# EAGLE schematic 1-voice(1_1) (EAGLE 9.2.1)

## Sheet 1 of 2
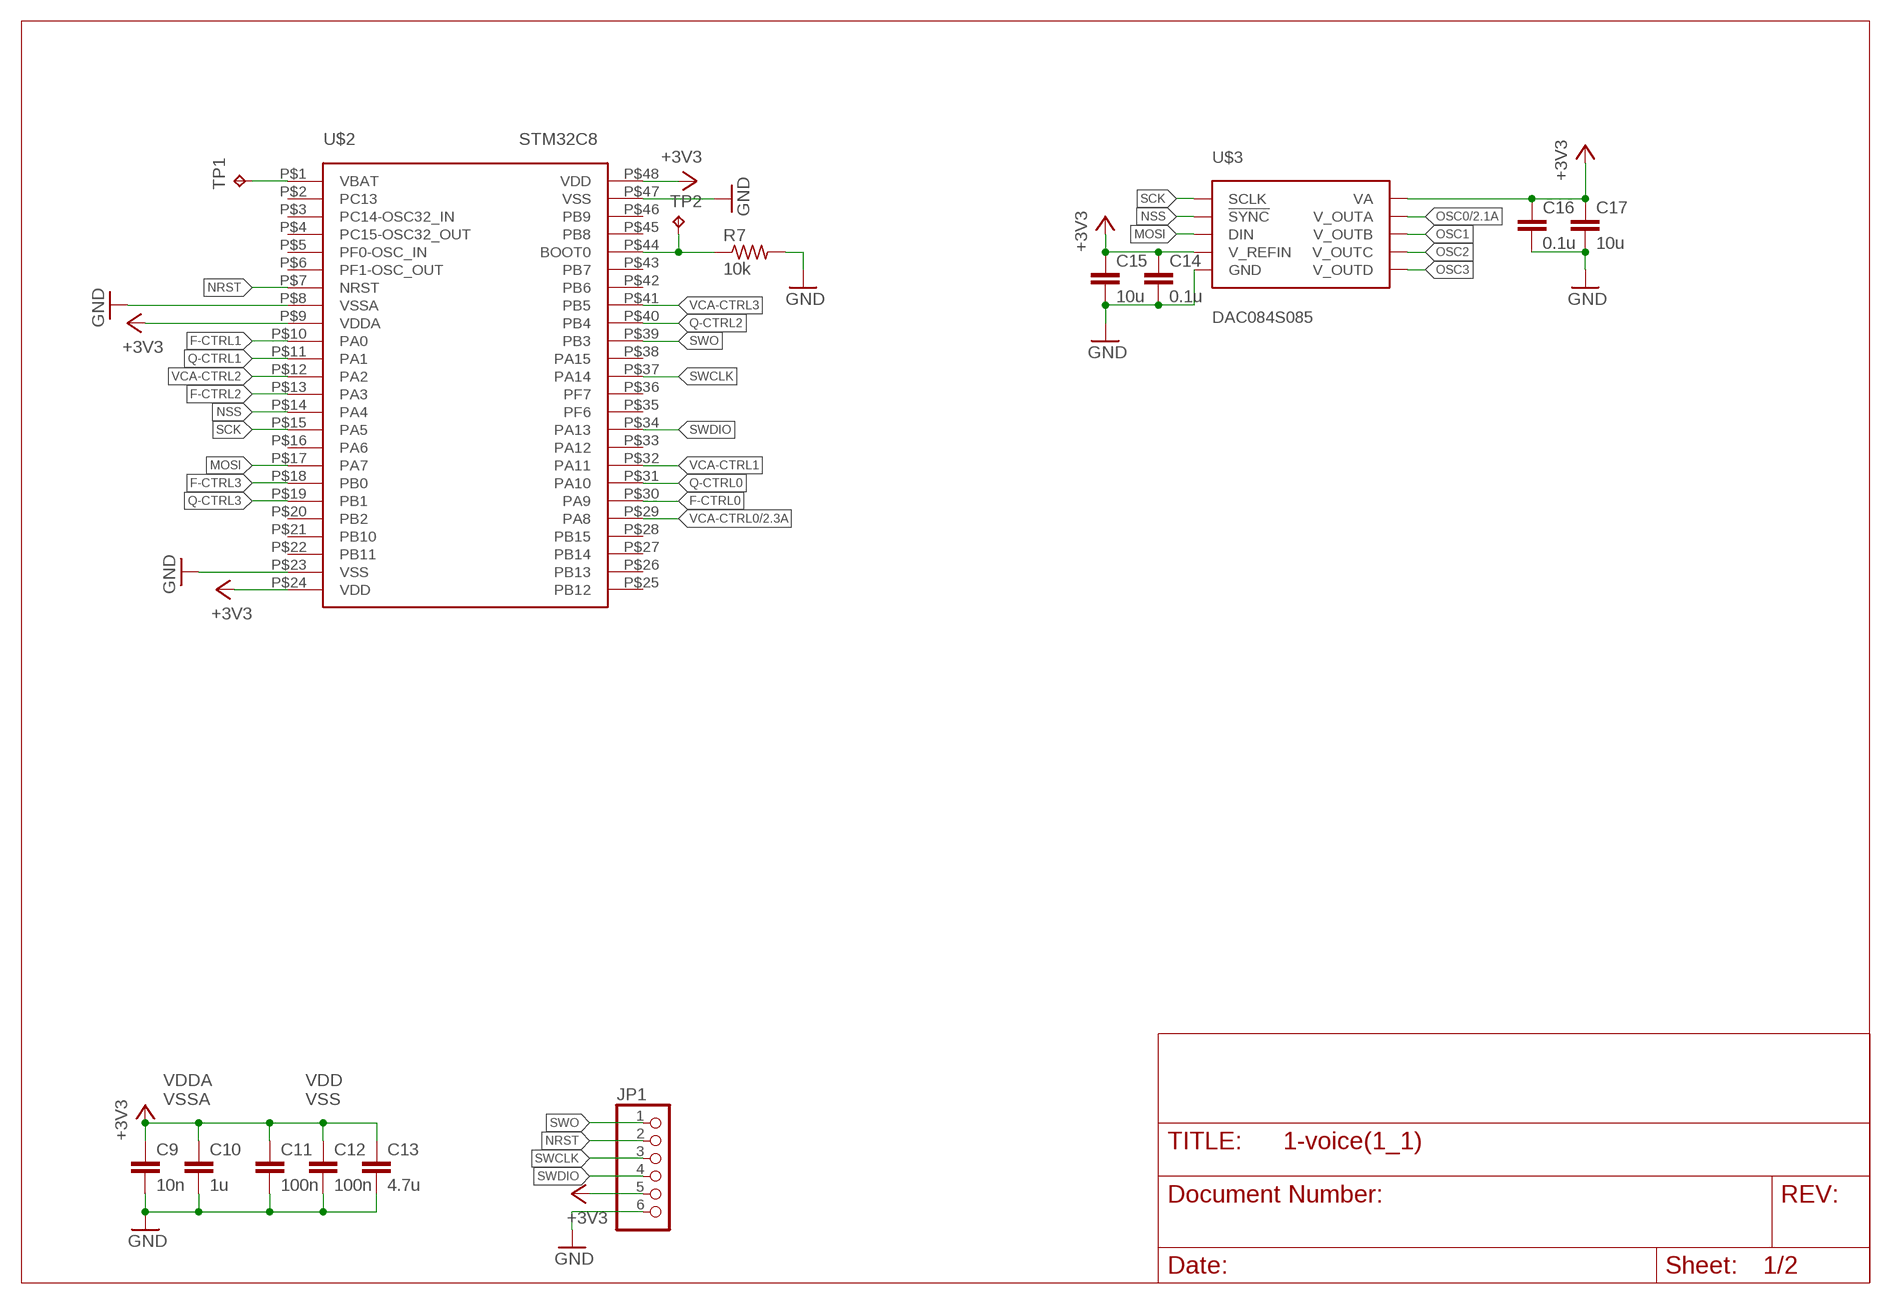
[diagram p0: schematic, sheet 1]

### Parts
C9  10n  C-EUC1206  [C1206]
C10  1u  C-EUC1206  [C1206]
C11  100n  C-EUC1206  [C1206]
C12  100n  C-EUC1206  [C1206]
C13  4.7u  C-EUC1206  [C1206]
C14  0.1u  C-EUC1206  [C1206]
C15  10u  C-EUC1206  [C1206]
C16  0.1u  C-EUC1206  [C1206]
C17  10u  C-EUC1206  [C1206]
JP1  PINHD-1X6  [1X06]
R7  10k  R-US_R1206  [R1206]
TP1  TPPAD1-13  [P1-13]
TP2  TPPAD1-13  [P1-13]
U$2  STM32C8  [LQFP48]
U$3  DAC084S085  [VSSOP10]

### Nets
+3V3: C9.1 C10.1 C11.1 C12.1 C13.1 C14.1 C15.1 C16.1 C17.1 JP1.5 U$2.P$9(VDDA) U$2.P$24(VDD) U$2.P$48(VDD) U$3.P$1(VA) U$3.P$7(V_REFIN)
F-CTRL0: U$2.P$30(PA9)
F-CTRL1: U$2.P$10(PA0)
F-CTRL2: U$2.P$13(PA3)
F-CTRL3: U$2.P$18(PB0)
GND: C9.2 C10.2 C11.2 C12.2 C13.2 C14.2 C15.2 C16.2 C17.2 JP1.6 R7.2 U$2.P$8(VSSA) U$2.P$23(VSS) U$2.P$47(VSS) U$3.P$6(GND) ; also sheet 2
MOSI: U$2.P$17(PA7) U$3.P$8(DIN)
N$7: TP1.TP U$2.P$1(VBAT)
N$8: R7.1 TP2.TP U$2.P$44(BOOT0)
NRST: JP1.2 U$2.P$7(NRST)
NSS: U$2.P$14(PA4) U$3.P$9(!SYNC)
OSC0: U$3.P$2(V_OUTA) ; also sheet 2
OSC1: U$3.P$3(V_OUTB)
OSC2: U$3.P$4(V_OUTC)
OSC3: U$3.P$5(V_OUTD)
Q-CTRL0: U$2.P$31(PA10)
Q-CTRL1: U$2.P$11(PA1)
Q-CTRL2: U$2.P$40(PB4)
Q-CTRL3: U$2.P$19(PB1)
SCK: U$2.P$15(PA5) U$3.P$10(SCLK)
SWCLK: JP1.3 U$2.P$37(PA14)
SWDIO: JP1.4 U$2.P$34(PA13)
SWO: JP1.1 U$2.P$39(PB3)
VCA-CTRL0: U$2.P$29(PA8) ; also sheet 2
VCA-CTRL1: U$2.P$32(PA11)
VCA-CTRL2: U$2.P$12(PA2)
VCA-CTRL3: U$2.P$41(PB5)
Unconnected: U$2.P$2(PC13) U$2.P$3(PC14-OSC32_IN) U$2.P$4(PC15-OSC32_OUT) U$2.P$5(PF0-OSC_IN) U$2.P$6(PF1-OSC_OUT) U$2.P$16(PA6) U$2.P$20(PB2) U$2.P$21(PB10) U$2.P$22(PB11) U$2.P$25(PB12) U$2.P$26(PB13) U$2.P$27(PB14) U$2.P$28(PB15) U$2.P$33(PA12) U$2.P$35(PF6) U$2.P$36(PF7) U$2.P$38(PA15) U$2.P$42(PB6) U$2.P$43(PB7) U$2.P$45(PB8) U$2.P$46(PB9)

### Notes on the sheet
- VDDA
  VSSA
- VDD
  VSS

## Sheet 2 of 2
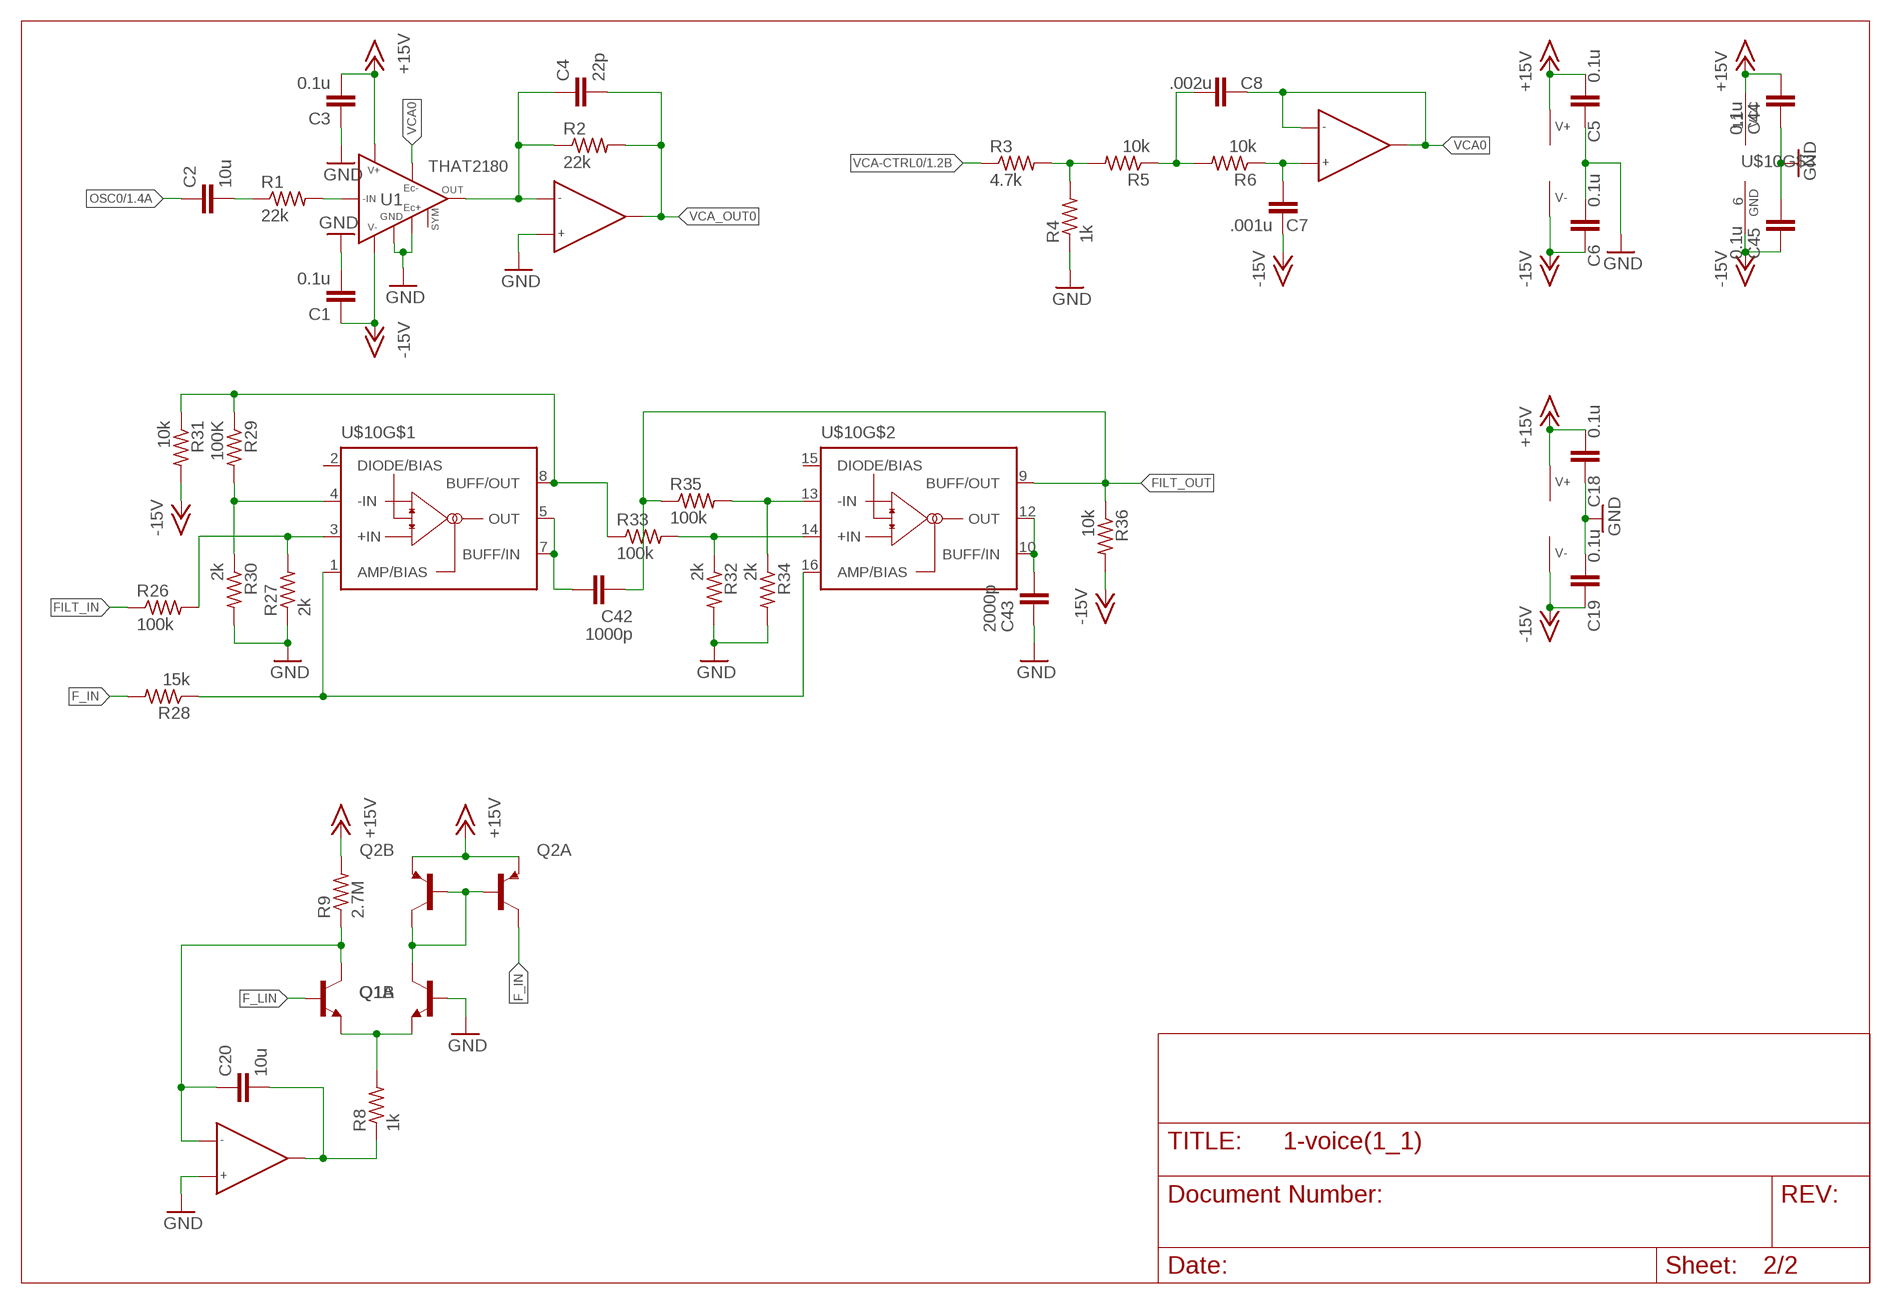
[diagram p1: schematic, sheet 2]

### Parts
C1  0.1u  C-EUC1206  [C1206]
C2  10u  C-EUC1206  [C1206]
C3  0.1u  C-EUC1206  [C1206]
C4  22p  C-EUC1206  [C1206]
C5  0.1u  C-EUC1206  [C1206]
C6  0.1u  C-EUC1206  [C1206]
C7  .001u  C-EUC1206  [C1206]
C8  .002u  C-EUC1206  [C1206]
C18  0.1u  C-EUC1206  [C1206]
C19  0.1u  C-EUC1206  [C1206]
C20  10u  C-EUC1206  [C1206]
C42  1000p  C-EUC1206  [C1206]
C43  2000p  C-EUC1206  [C1206]
C44  0.1u  C-EUC1206  [C1206]
C45  0.1u  C-EUC1206  [C1206]
Q1  TRANS-BJT_NPN-DUAL-BC847BS-JBLMASK  [SOT-363-JBLMASK]
Q2  TRANS-BJT_PNP-DUAL-BC857-JBLMASK  [SOT-363-JBLMASK]
R1  22k  R-US_R1206  [R1206]
R2  22k  R-US_R1206  [R1206]
R3  4.7k  R-US_R1206  [R1206]
R4  1k  R-US_R1206  [R1206]
R5  10k  R-US_R1206  [R1206]
R6  10k  R-US_R1206  [R1206]
R8  1k  R-US_R1206  [R1206]
R9  2.7M  R-US_R1206  [R1206]
R26  100k  R-US_R1206  [R1206]
R27  2k  R-US_R1206  [R1206]
R28  15k  R-US_R1206  [R1206]
R29  100K  R-US_R1206  [R1206]
R30  2k  R-US_R1206  [R1206]
R31  10k  R-US_R1206  [R1206]
R32  2k  R-US_R1206  [R1206]
R33  100k  R-US_R1206  [R1206]
R34  2k  R-US_R1206  [R1206]
R35  100k  R-US_R1206  [R1206]
R36  10k  R-US_R1206  [R1206]
U1  THAT2180  [SIP8]
U$1  TL072  [SOIC8]
U$10  XX-13700DMP16  [DMP16]
U$11  TL072  [SOIC8]

### Nets
+15V: C3.2 C5.2 C18.2 C44.1 Q2.1(A:E) Q2.4(B:E) R9.2 U1.$P7(V+) U$1.P$8(V+) U$10.11(VCC) U$11.P$8(V+)
-15V: C1.1 C6.1 C7.1 C19.1 C45.2 R31.2 R36.2 U1.$P5(V-) U$1.P$4(V-) U$10.6(GND) U$11.P$4(V-)
F_IN: Q2.6(A:C) R28.2
F_LIN: Q1.2(A:B)
FILT_IN: R26.1
FILT_OUT: C42.2 R35.1 R36.1 U$10.9(BUFF/OUT)
GND: C1.2 C3.1 C5.1 C6.2 C18.1 C19.2 C43.2 C44.2 C45.1 Q1.5(B:B) R4.1 R27.1 R30.2 R32.2 R34.2 U1.$P2(EC+) U1.$P6(GND) U$1.P$3(IN+) U$11.P$3(IN+) ; also sheet 1
N$1: C2.2 R1.1
N$2: R1.2 U1.$P1(-IN)
N$3: C4.1 R2.1 U1.$P8(OUT) U$1.P$2(IN-)
N$4: R3.2 R4.2 R5.2
N$5: C8.2 R5.1 R6.2
N$6: C7.2 R6.1 U$1.P$5(IN+)
N$9: Q1.1(A:E) Q1.4(B:E) R8.2
N$10: C20.2 R8.1 U$11.P$1(OUT)
N$11: C20.1 Q1.6(A:C) R9.1 U$11.P$2(IN-)
N$13: Q1.3(B:C) Q2.2(A:B) Q2.3(B:C) Q2.5(B:B)
N$27: R26.2 R27.2 U$10.3(+IN)
N$28: R28.1 U$10.1(AMP/BIAS) U$10.16(AMP/BIAS)
N$31: R29.2 R30.1 U$10.4(-IN)
N$32: C42.1 U$10.5(OUT) U$10.7(BUFF/IN)
N$33: R29.1 R31.1 R33.1 U$10.8(BUFF/OUT)
N$34: C43.1 U$10.10(BUFF/IN) U$10.12(OUT)
N$35: R32.1 R33.2 U$10.14(+IN)
N$36: R34.1 R35.2 U$10.13(-IN)
OSC0: C2.1 ; also sheet 1
VCA0: C8.1 U1.$P3(EC-) U$1.P$6(IN-) U$1.P$7(OUT)
VCA-CTRL0: R3.1 ; also sheet 1
VCA_OUT0: C4.2 R2.2 U$1.P$1(OUT)
Unconnected: U1.$P4(SYM) U$10.2(DIODE/BIAS) U$10.15(DIODE/BIAS) U$11.P$5(IN+) U$11.P$6(IN-) U$11.P$7(OUT)

## Library data of the parts
C1-C20 = rcl:C-EU: CAPACITOR, European symbol; SPICEPREFIX: C
C42-C45 = resistor:C-EU: CAPACITOR, European symbol
JP1 = pinhead:PINHD-1X6: PIN HEADER
Q1 = LITTLEBITS:TRANS-BJT_NPN-DUAL
Q2 = LITTLEBITS:TRANS-BJT_PNP-DUAL
R1-R7 = rcl:R-US_: RESISTOR, American symbol; SPICEPREFIX: R
R8 R9 R26-R36 = resistor:R-US_: RESISTOR, American symbol
TP1 TP2 = testpad:TP: Test pad
U1 = synth:THAT2180
U$1 U$11 = synth:TL072
U$2 = synth:STM32C8
U$3 = synth:DAC084S085
U$10 = LITTLEBITS:XX-13700